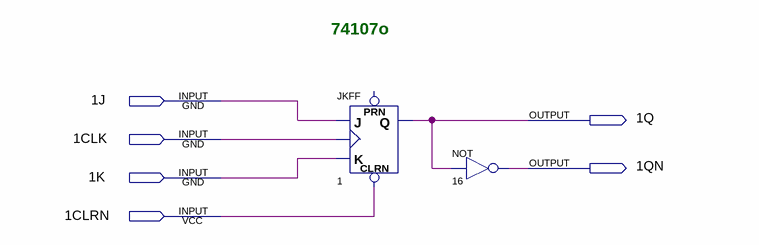
[diagram p0: schematic sheet]
// Quartus schematic 74LS107.bdf as structural Verilog: 2 symbols, 6 pins
module \74LS107  (
  input  \1J ,
  input  \1CLK ,
  input  \1K ,
  input  \1CLRN ,
  output \1Q ,
  output \1QN 
);

  JKFF u_1 (.CLRN(\1CLRN ), .K(\1K ), .J(\1J ), .CLK(\1CLK ), .Q(\1Q ));  // open: PRN
  not u_16 (\1QN , \1Q );

  // Notes on the sheet:
  //   74107o
endmodule
